# EAGLE design Placa ATMEL 2019 (EAGLE 7.6.0)
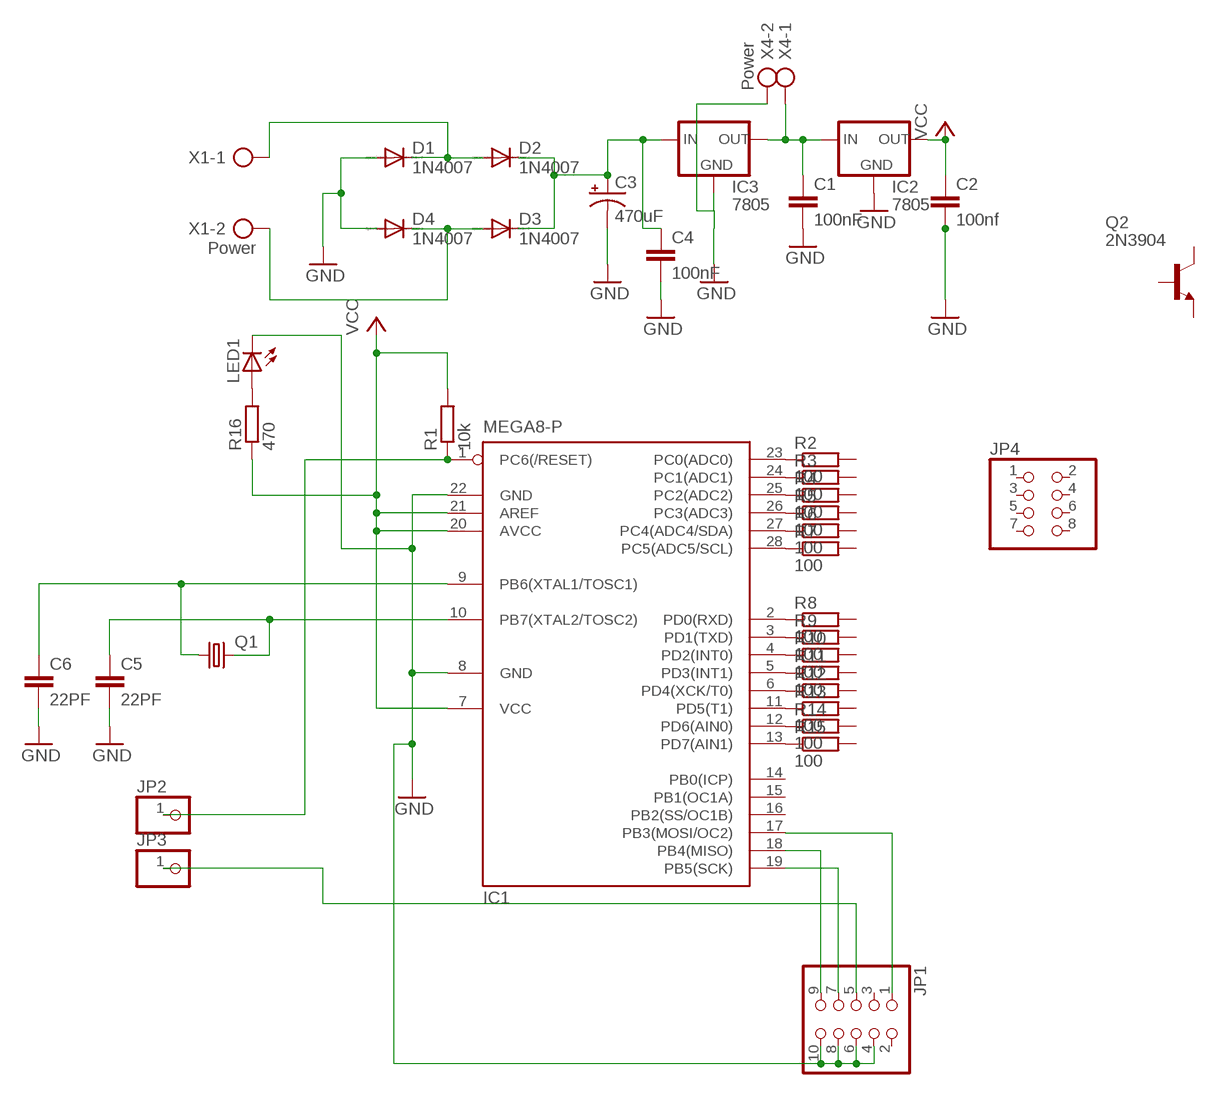
[diagram p0: schematic, sheet 1]

## Parts
C1  100nF  C-EU050-025X075  [C050-025X075]
C2  100nf  C-EU050-025X075  [C050-025X075]
C3  470uF  CPOL-USE7.5-16  [E7,5-16]
C4  100nF  C-EU050-025X075  [C050-025X075]
C5  22PF  C-EU050-024X044  [C050-024X044]
C6  22PF  C-EU050-024X044  [C050-024X044]
D1  1N4007  1N4004  [DO41-10]
D2  1N4007  1N4004  [DO41-10]
D3  1N4007  1N4004  [DO41-10]
D4  1N4007  1N4004  [DO41-10]
IC1  MEGA8-P  [DIL28-3]
IC2  7805  78XXL  [78XXL]
IC3  7805  78XXL  [78XXL]
JP1  PINHD-2X5  [2X05]
JP2  PINHD-1X1  [1X01]
JP3  PINHD-1X1  [1X01]
JP4  PINHD-2X4  [2X04]
LED1  LED5MM  [LED5MM]
Q1  CRYSTALHC49S  [HC49/S]
Q2  2N3904  [TO92]
R1  10k  R-EU_0207/10  [0207/10]
R2  100  R-EU_0207/10  [0207/10]
R3  100  R-EU_0207/10  [0207/10]
R4  100  R-EU_0207/10  [0207/10]
R5  100  R-EU_0207/10  [0207/10]
R6  100  R-EU_0207/10  [0207/10]
R7  100  R-EU_0207/10  [0207/10]
R8  100  R-EU_0207/10  [0207/10]
R9  100  R-EU_0207/10  [0207/10]
R10  100  R-EU_0207/10  [0207/10]
R11  100  R-EU_0207/10  [0207/10]
R12  R-EU_0207/10  [0207/10]
R13  100  R-EU_0207/10  [0207/10]
R14  100  R-EU_0207/10  [0207/10]
R15  100  R-EU_0207/10  [0207/10]
R16  470  R-EU_0309/10  [0309/10]
X1  Power  AK500/2  [AK500/2]
X4  Power  AK500/2  [AK500/2]

## Nets
GND: C1.2 C2.2 C3.- C4.2 C5.2 C6.2 D1.A D4.A IC1.8(GND) IC1.22(GND) IC2.GND IC3.GND JP1.4 JP1.6 JP1.8 JP1.10 LED1.K(C) X4.2
N$1: JP1.5 JP3.1
N$2: IC1.23(PC0(ADC0)) R2.1
N$3: IC1.24(PC1(ADC1)) R3.1
N$4: IC1.25(PC2(ADC2)) R4.1
N$5: IC1.27(PC4(ADC4/SDA)) R6.1
N$6: IC1.28(PC5(ADC5/SCL)) R7.1
N$7: IC1.2(PD0(RXD)) R8.1
N$8: IC1.3(PD1(TXD)) R9.1
N$9: IC1.4(PD2(INT0)) R10.1
N$10: IC1.5(PD3(INT1)) R11.1
N$11: IC1.6(PD4(XCK/T0)) R12.1
N$12: IC1.11(PD5(T1)) R13.1
N$13: IC1.12(PD6(AIN0)) R14.1
N$14: IC1.13(PD7(AIN1)) R15.1
N$15: IC1.26(PC3(ADC3)) R5.1
N$16: IC1.17(PB3(MOSI/OC2)) JP1.1
N$17: LED1.A R16.2
N$18: IC1.19(PB5(SCK)) JP1.7
N$19: IC1.18(PB4(MISO)) JP1.9
N$22: C3.+ C4.1 D2.C D3.C IC3.IN
N$24: D1.C D2.A X1.1
N$65: D3.A D4.C X1.2
N$111: IC1.1(PC6(/RESET)) JP2.1 R1.1
N$116: C1.1 IC2.IN IC3.OUT X4.1
N$135: C5.1 IC1.10(PB7(XTAL2/TOSC2)) Q1.2
N$136: C6.1 IC1.9(PB6(XTAL1/TOSC1)) Q1.1
VCC: C2.1 IC1.7(VCC) IC1.20(AVCC) IC1.21(AREF) IC2.OUT R1.2 R16.1
Unconnected: IC1.14(PB0(ICP)) IC1.15(PB1(OC1A)) IC1.16(PB2(SS/OC1B)) JP1.2 JP1.3 JP4.1 JP4.2 JP4.3 JP4.4 JP4.5 JP4.6 JP4.7 JP4.8 Q2.1(C) Q2.2(B) Q2.3(E) R2.2 R3.2 R4.2 R5.2 R6.2 R7.2 R8.2 R9.2 R10.2 R11.2 R12.2 R13.2 R14.2 R15.2

## Library data of the parts
C1 C2 C4-C6 = rcl:C-EU: CAPACITOR, European symbol
C3 = rcl:CPOL-US: POLARIZED CAPACITOR, American symbol
D1-D4 = diode:1N4004: DIODE general purpose rectifier, 1 A
IC1 = atmel:MEGA8-P: MICROCONTROLLER 8 Kbytes FLASH, 1 kbytes SRAM, 512 bytes EEPROM, USART, 4-channel 10 bit ADC, 2-channel 8 bit ADC Pin compatible with Atmega48, ATMega88, ATMega168 Source: avr.lbr; OC_FARNELL: unknown; OC_NEWARK: unknown
IC2 IC3 = v-reg:78XXL: VOLTAGE REGULATOR
JP1 = pinhead:PINHD-2X5: PIN HEADER
JP2 JP3 = pinhead:PINHD-1X1: PIN HEADER
JP4 = pinhead:PINHD-2X4: PIN HEADER
LED1 = led:LED: LED OSRAM: - CHIPLED LG R971, LG N971, LY N971, LG Q971, LY Q971, LO R971, LY R971 LH N974, LH R974 LS Q976, LO Q976, LY Q976 LO Q996 - Hyper CHIPLED LW Q18S LB Q993, LB Q99A, LB R99A - SideLED LS A670, LO A670, LY A670, LG A670, LP A670 LB A673, LV A673, LT A673, LW A673 LH A674 LY A675 LS A676, LA A676, LO A676, LY A676, LW A676 LS A679, LY A679, LG A679 - Hyper Micro SIDELED® LS Y876, LA Y876, LO Y876, LY Y876 LT Y87S - SmartLED LW L88C, LW L88S LB L89C, LB L89S, LG L890 LS L89K, LO L89K, LY L89K LS L896, LA L896, LO L896, LY L896 - TOPLED LS T670, LO T670, LY T670, LG T670, LP T670 LSG T670, LSP T670, LSY T670, LOP T670, LYG T670 LG T671, LOG T671, LSG T671 LB T673, LV T673, LT T673, LW T673 LH T674 LS T676, LA T676, LO T676, LY T676, LB T676, LH T676, LSB T676, LW T676 LB T67C, LV T67C, LT T67C, LS T67K, LO T67K, LY T67K, LW E67C LS E67B, LA E67B, LO E67B, LY E67B, LB E67C, LV E67C, LT E67C LW T67C LS T679, LY T679, LG T679 LS T770, LO T770, LY T770, LG T770, LP T770 LB T773, LV T773, LT T773, LW T773 LH T774 LS E675, LA E675, LY E675, LS T675 LS T776, LA T776, LO T776, LY T776, LB T776 LHGB T686 LT T68C, LB T68C - Hyper Mini TOPLED® LB M676 - Mini TOPLED Santana® LG M470 LS M47K, LO M47K, LY M47K Source: http://www.osram.convergy.de LUXEON: - LUMILED® LXK2-PW12-R00, LXK2-PW12-S00, LXK2-PW14-U00, LXK2-PW14-V00 LXK2-PM12-R00, LXK2-PM12-S00, LXK2-PM14-U00 LXK2-PE12-Q00, LXK2-PE12-R00, LXK2-PE12-S00, LXK2-PE14-T00, LXK2-PE14-U00 LXK2-PB12-K00, LXK2-PB12-L00, LXK2-PB12-M00, LXK2-PB14-N00, LXK2-PB14-P00, LXK2-PB14-Q00 LXK2-PR12-L00, LXK2-PR12-M00, LXK2-PR14-Q00, LXK2-PR14-R00 LXK2-PD12-Q00, LXK2-PD12-R00, LXK2-PD12-S00 LXK2-PH12-R00, LXK2-PH12-S00 LXK2-PL12-P00, LXK2-PL12-Q00, LXK2-PL12-R00 Source: www.luxeon.com KINGBRIGHT: KA-3528ASYC Source: www.kingbright.com
Q1 = crystal:CRYSTAL: CRYSTAL; OC_FARNELL: 1667008; OC_NEWARK: unknown
Q2 = transistor-npn:2N3904: NPN Transistor
R1-R16 = rcl:R-EU_: RESISTOR, European symbol
X1 X4 = con-ptr500:AK500/2: CONNECTOR

## Board
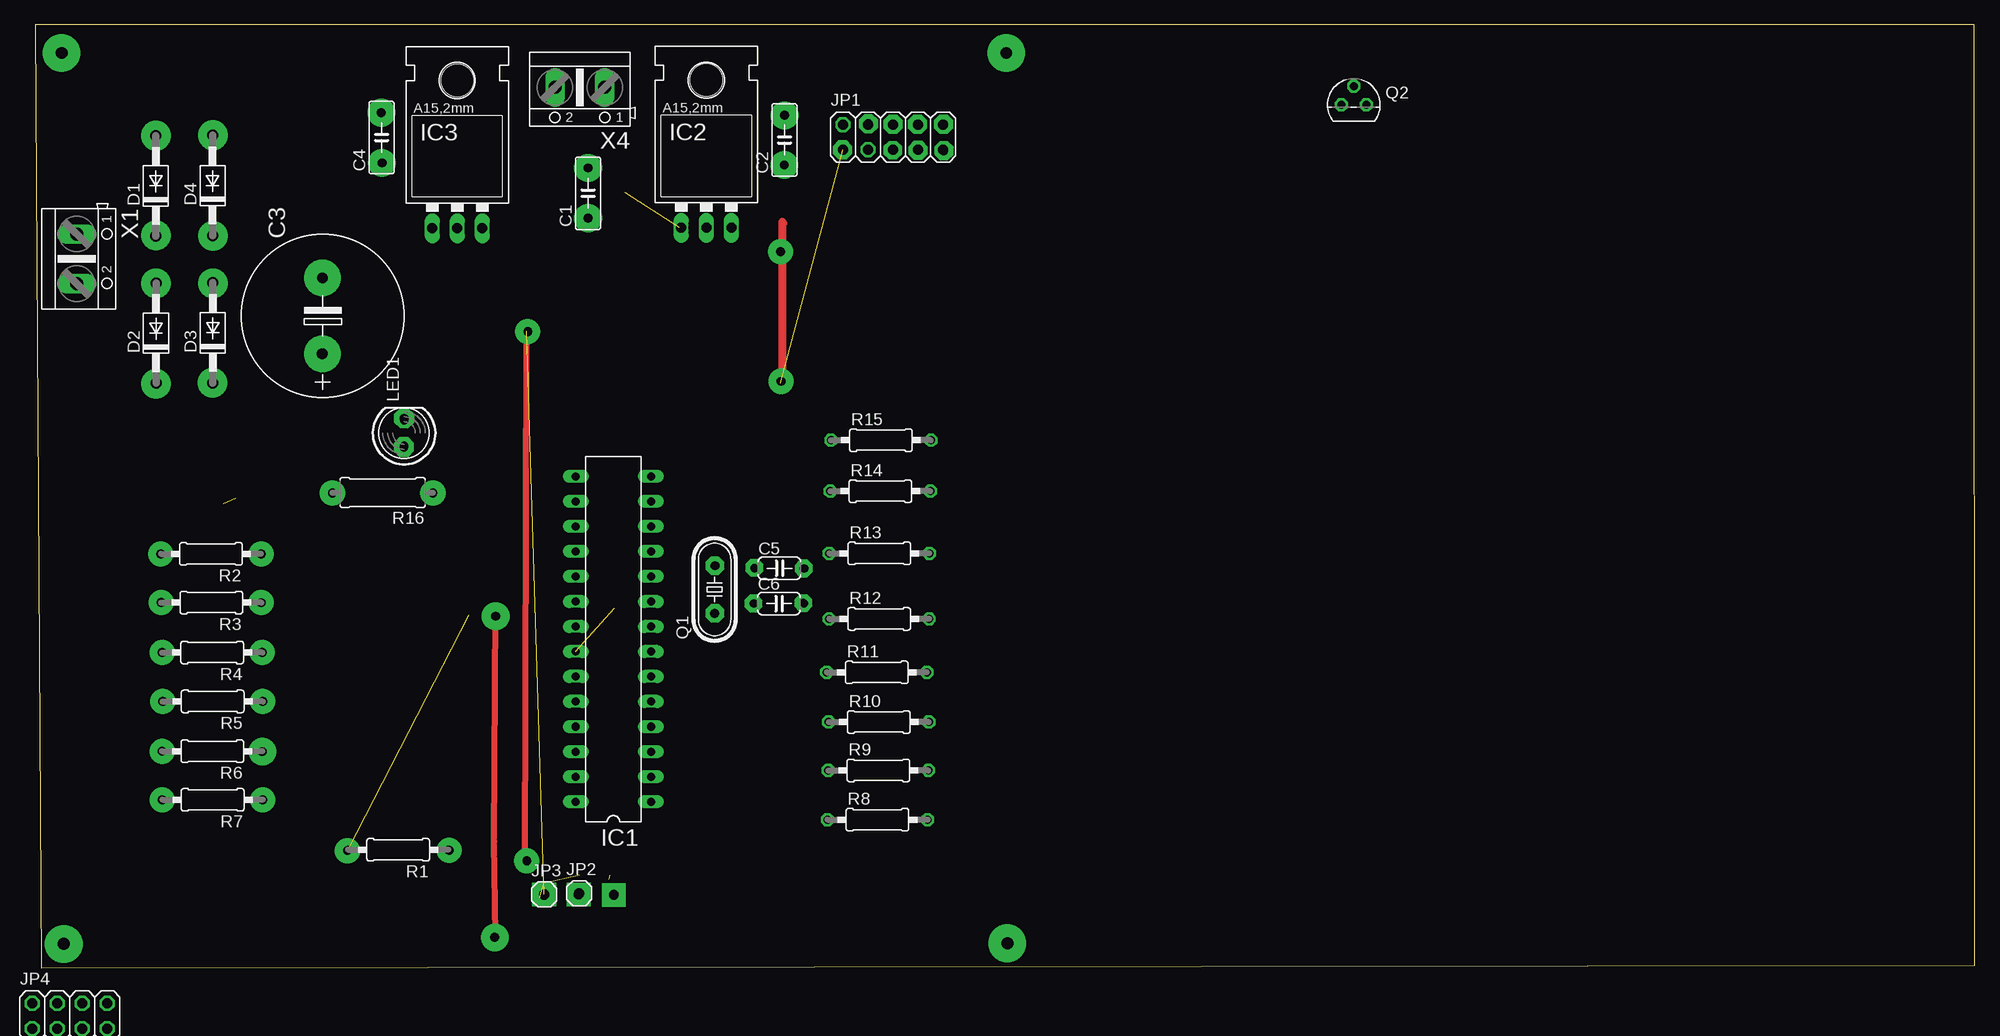
[diagram p1: board, top side]
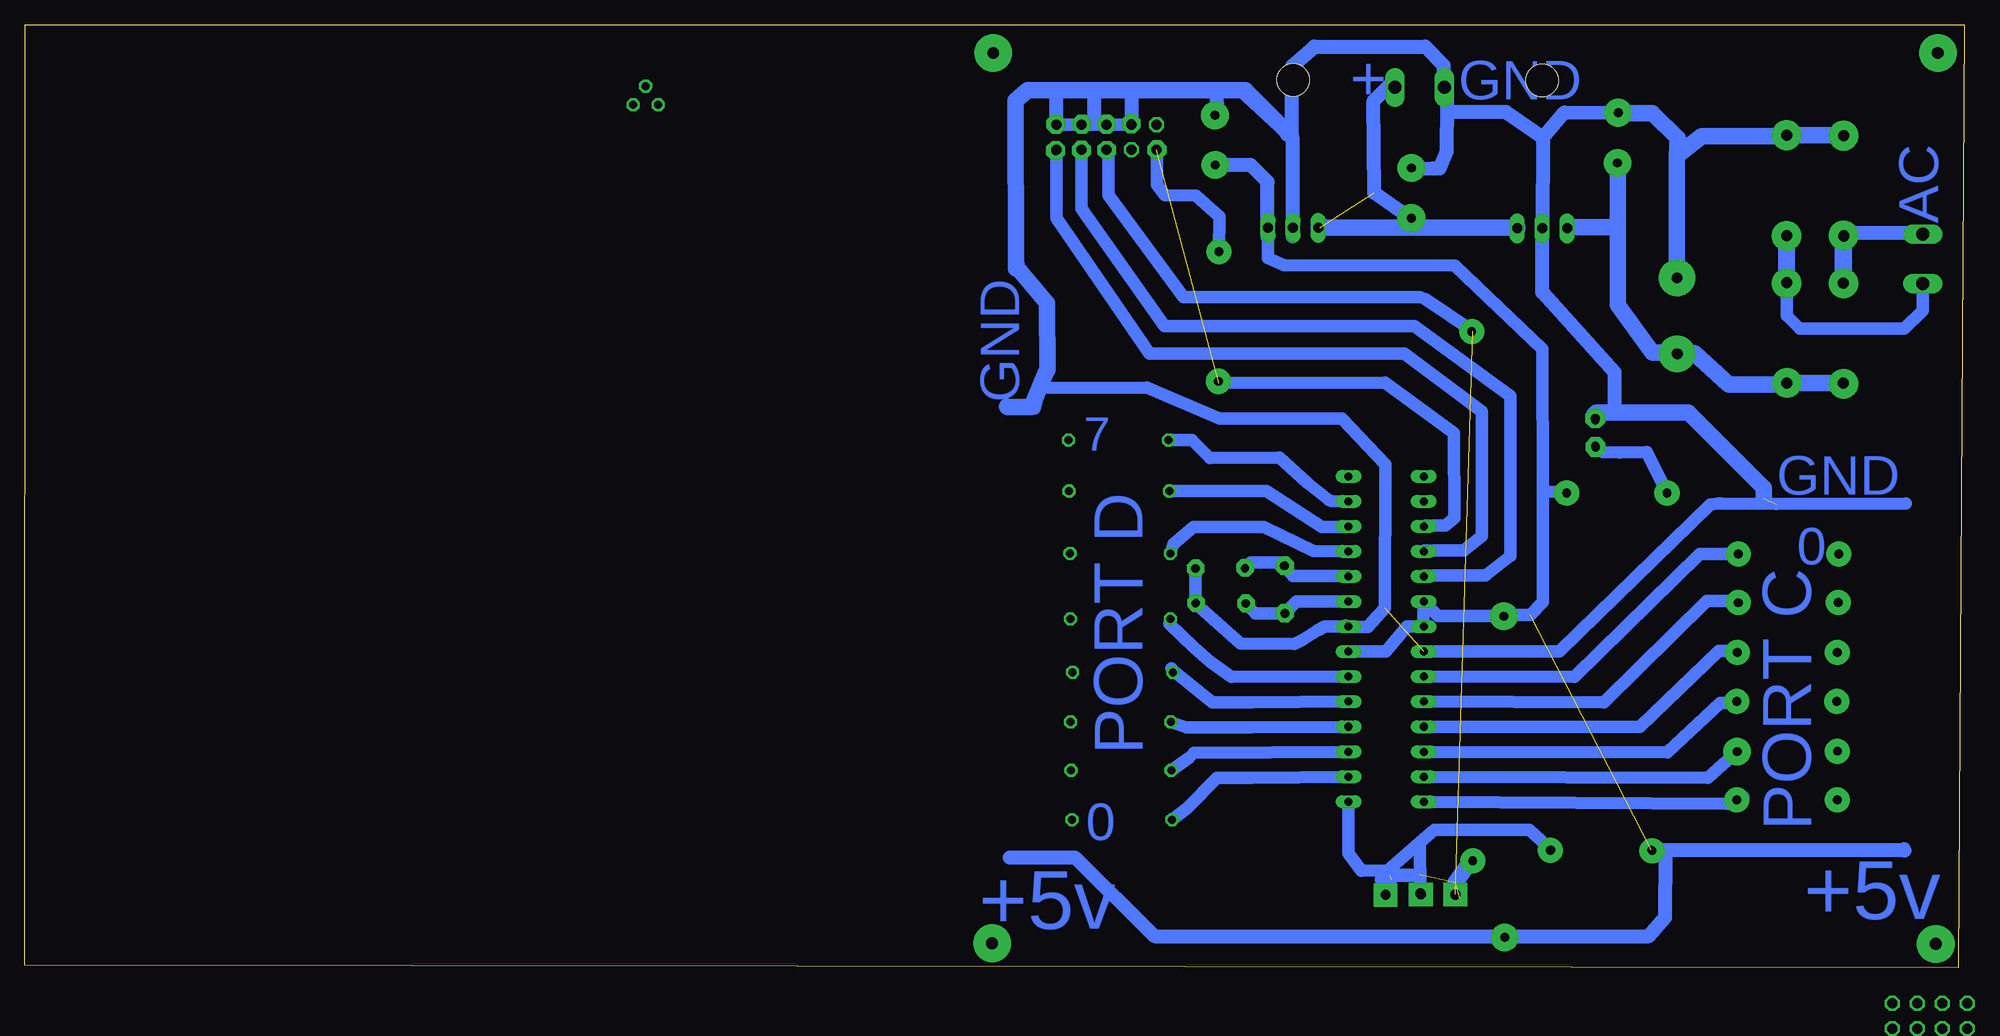
[diagram p2: board, bottom side, seen from below]

Size 196.74 x 95.72 mm. Coordinates in mm from the lower left corner, seen from the top.
Outline: 0.57,0 196.74,0.28 196.7,95.72 0,95.7 0.57,0
Copper layers (1*16): Top 0.035mm / dielectric 1.5mm / Bottom 0.035mm
Design rules "default *": minimum track width 10mil, minimum drill 24mil, track to track 8mil, track to pad 8mil, pad to pad 8mil, via to via 8mil, smd to smd 8mil, copper to edge 40mil, drill to drill 8mil, minimum pad ring 10mil, minimum via ring 8mil, stop-mask expansion 4mil, vias tented up to drill 0mil, thermal gap 10mil

### Footprints (pad centres in the part's own frame; a part is rotated, then mirrored left to right if it is on the bottom)
C050-025X075 = drill 0.813 octagon: 1 -2.54,0; 2 2.54,0
E7,5-16 = drill 1.016 pad 3.15: + -3.81,0 | drill 1.016 pad 3.15 octagon: - 3.81,0
C050-024X044 = drill 0.813 octagon: 1 -2.54,0; 2 2.54,0
DO41-10 = drill 1.118: A 5.08,0; C -5.08,0
DIL28-3 = drill 0.813 long: 1 -16.51,-3.81; 2 -13.97,-3.81; 3 -11.43,-3.81; 4 -8.89,-3.81; 5 -6.35,-3.81; 6 -3.81,-3.81; 7 -1.27,-3.81; 8 1.27,-3.81; 9 3.81,-3.81; 10 6.35,-3.81; 11 8.89,-3.81; 12 11.43,-3.81; 13 13.97,-3.81; 14 16.51,-3.81; 15 16.51,3.81; 16 13.97,3.81; 17 11.43,3.81; 18 8.89,3.81; 19 6.35,3.81; 20 3.81,3.81; 21 1.27,3.81; 22 -1.27,3.81; 23 -3.81,3.81; 24 -6.35,3.81; 25 -8.89,3.81; 26 -11.43,3.81; 27 -13.97,3.81; 28 -16.51,3.81
78XXL = drill 1.016 long: GND 0,-3.81; IN -2.54,-3.81; OUT 2.54,-3.81 | hole 3.302: 0,11.176
2X05 = drill 1.016 octagon: 1 -5.08,-1.27; 2 -5.08,1.27; 3 -2.54,-1.27; 4 -2.54,1.27; 5 0,-1.27; 6 0,1.27; 7 2.54,-1.27; 8 2.54,1.27; 9 5.08,-1.27; 10 5.08,1.27
1X01 = drill 1.016 octagon: 1 0,0
2X04 = drill 1.016 octagon: 1 -3.81,-1.27; 2 -3.81,1.27; 3 -1.27,-1.27; 4 -1.27,1.27; 5 1.27,-1.27; 6 1.27,1.27; 7 3.81,-1.27; 8 3.81,1.27
LED5MM = drill 0.813 octagon: A -1.27,0; K 1.27,0
HC49/S = drill 0.813: 1 -2.413,0; 2 2.413,0
TO92 = drill 0.813 octagon: 1 1.27,0; 2 0,1.905; 3 -1.27,0
0207/10 = drill 0.813 octagon: 1 -5.08,0; 2 5.08,0
0309/10 = drill 0.813 octagon: 1 -5.08,0; 2 5.08,0
AK500/2 = drill 1.321 long: 1 -2.515,0; 2 2.515,0

### Placement (x,y rotation side)
C1  56.05,78.61 90 top
C2  75.98,84.02 90 top
C3  29.15,66.17 90 top
C4  35.11,84.26 90 top
C5  75.47,40.56 0 top
C6  75.42,36.98 0 top
D1  12.22,79.36 90 top
D2  12.23,64.42 90 top
D3  17.99,64.45 90 top
D4  17.98,79.4 90 top
IC1  58.63,33.38 90 top
IC2  68.06,78.91 0 top
IC3  42.79,78.88 0 top
JP1  86.99,84.31 0 top
JP2  55.17,7.6 0 top
JP3  51.62,7.46 0 top
JP4  3.48,-4.87 0 top  (outside the outline)
LED1  37.4,54.28 90 top
Q1  68.9,38.41 90 top
Q2  133.74,87.59 0 top
R1  36.8,12 180 top
R2  17.81,42.02 180 top
R3  17.84,37.08 180 top
R4  17.93,32.01 180 top
R5  17.98,27.05 180 top
R6  17.94,22 180 top
R7  17.98,17.07 180 top
R8  85.42,15.05 0 top
R9  85.51,20.05 0 top
R10  85.55,24.95 0 top
R11  85.35,30 0 top
R12  85.59,35.42 0 top
R13  85.61,42.07 0 top
R14  85.71,48.38 0 top
R15  85.77,53.55 0 top
R16  35.22,48.24 180 top
X1  4.19,71.96 270 top
X4  55.23,89.36 180 top

### Tracks (layer width: path | path; a pad name or v marks a point on that pad's centre or on a via)
GND  (via drill 0.9 pad 2)  (2 unrouted)
  Bottom 0.406: 97.08,56.88 96.98,56.88 96.98,56.79 94.29,56.79 94.29,57.7
  Bottom 1.27: 97.08,56.76 97.08,56.88 | IC2.GND 68.1,74.26 | 84.45,88.88 82.96,88.94 75.79,88.94 73.44,89.08 68.1,84.1 68.23,84.19 | JP1.4 JP1.6 JP1.8 JP1.10 | 52.44,86.86 52.44,87.82 X4.2 | C5.2 77.97,39.82 C6.2 73.41,32.95 67.94,32.9 67.14,33.3 65.58,34.26 64.84,34.64 IC1.8 62.74,34.75 62.69,34.61 60.5,34.6 58.75,36.55 | 58.75,36.55 60.05,35.11 | 37.49,56.17 37.49,55.86 v37.42,55.78 v37.4,55.78 v37.39,55.77 v37.4,55.76 LED1.K | 5.94,47.11 19.03,47.09 24.65,47.11 24.95,47.14 25.75,47.05 41.07,32.1 54.79,32.14 IC1.22 | 94.29,56.79 93.8,58.85 82.87,58.88 75.54,55.73 63.11,55.73 58.7,51.1 58.75,36.55
  Bottom 1.422: 68.1,74.26 68.1,84.1 | 84.45,88.88 JP1.4 | 42.73,84.23 40.53,86.82 C4.2 | 42.73,84.23 46.47,86.86 52.44,86.86 | C1.2 53.91,81.13 53.18,81.15 52.48,82.81 52.44,87.82 | C2.2 75.72,86.82 75.79,88.94 | 68.23,84.19 68.16,84.45 68.16,91.51 65.91,93.5 54.66,93.5 52.81,91.59 X4.2 | 42.83,74.71 IC3.GND | 42.73,84.23 42.77,74.95 IC3.GND | 27.97,56.35 28.04,56.42 35.18,56.42 35.45,56.69 35.45,60.43 42.79,68.57 IC3.GND
  Bottom 1.676: D1.A 12.26,84.48 D4.A 18.08,84.38 26.61,84.38 29.16,82.41 | 29.16,82.41 C3.- | C4.2 34.93,86.75 31.62,86.75 29.02,84.19 29.16,82.41 | 37.49,56.17 37.31,56.35 27.97,56.35 20.3,48.68 20.3,47.63
N$1  (1 unrouted)
  Bottom 1.27: JP1.5 86.82,82.68 86.82,78.41 79.18,68.09 55.22,68.08 54.63,67.85 49.81,64.62
N$2
  Bottom 1.27: R2.1 arc45 22.99,41.98 23.04,42.03 26.79,42.03 39.51,29.56 IC1.23
N$3
  Bottom 1.27: R3.1 23.1,37.26 26.1,37.26 36.54,26.94 IC1.24
N$4
  Bottom 1.27: R4.1 23.19,32.19 24.9,32.19 32.91,24.44 IC1.25
N$5
  Bottom 1.27: R6.1 25.98,19.27 IC1.27
N$6
  Bottom 1.27: 22.42,17.35 22.7,17.07 R7.1 23.31,17.32 23.97,16.66 IC1.28
N$7
  Bottom 1.27: IC1.2 72.31,19.29 75.77,19.29 78.85,16.21 R8.1
N$8
  Bottom 1.27: IC1.3 78.11,21.84 78.63,21.32 R9.1
N$9
  Bottom 1.27: IC1.4 72.35,24.41 78.86,24.41 80.43,24.9 R10.1
N$10
  Bottom 1.27: IC1.5 72.27,26.97 76.26,26.97 79.96,29.92 80.1,29.92 80.43,30.4 R11.1
N$11
  Bottom 1.27: IC1.6 74.34,29.56 76.45,31.08 78.13,32.55 80.59,34.89 R12.1
N$12
  Bottom 1.27: IC1.11 66.02,42.31 71.03,44.75 78.17,44.75 80.18,43 R13.1
N$13
  Bottom 1.27: IC1.12 62.51,44.74 65.14,44.76 70.79,48.38 R14.1
N$14
  Bottom 1.27: R15.1 80.66,53.58 78.33,53.58 76.5,51.75 69.45,51.78 66.63,49.23 64.43,47.48 64.18,47.39 IC1.13
N$15
  Bottom 1.27: R5.1 23.19,26.92 24.71,26.92 30.09,21.89 IC1.26
N$16  (1 unrouted)
  Bottom 1.27: IC1.17 54.61,44.88 52.62,44.88 51.7,45.64 51.75,54.29 58.73,59.38 75.57,59.37
N$17
  Bottom 1.27: R16.2 32.18,52.34 34.96,52.31 36.65,52.33 LED1.A
N$18
  Bottom 1.27: IC1.19 54.74,39.81 48.58,39.81 46.04,41.83 46.02,58.01 55.77,65.15 81.1,65.15 89.53,77.04 JP1.7
N$19
  Bottom 1.27: IC1.18 54.74,42.35 50.75,42.35 48.93,43.82 48.92,56.45 56.76,62.32 82.66,62.36 92.07,76.07 JP1.9
N$22
  Bottom 1.422: C3.+ 29.43,62.64 | IC3.IN 40.21,75.11
  Bottom 1.676: D2.C 12.26,59.37 D3.C 18.14,59.22 23.87,59.22 27.37,62.41 C3.+ | 29.43,62.64 29.63,62.44 31.64,62.44 35.14,67.27 35.11,75.17 | 35.11,75.17 C4.1 | 40.21,75.11 40.15,75.17 35.11,75.17
N$23  (via drill 0.9 pad 2)
  other vias: 37.38,52.87
N$24
  Bottom 1.27: X1.1 4.13,74.55 | 11.89,74.28 D1.C
  Bottom 1.422: 4.13,74.55 12.22,74.55 D1.C
  Bottom 1.8: D1.C D2.A
N$38  (via drill 0.9 pad 2.54)
  other vias: 49.85,10.86
N$41  (via drill 1.2 pad 3.81)
  other vias: 2.87,2.45
N$42  (via drill 1.2 pad 3.81)
  other vias: 98.6,2.51
N$43  (via drill 0.9 pad 1.93)
  other vias: 89.49,85.63
N$46  (via drill 0.9 pad 2.54)
  other vias: 31.65,11.91
N$47  (via drill 0.9 pad 2.54)
  other vias: 41.97,11.93
N$48
  Bottom 1.27: 75.57,72.76 75.55,76.24 77.92,78.38 81.06,78.41 81.89,79.47 81.89,82.78
N$49  (via drill 0.9 pad 2.54)
  other vias: 12.72,42.02
N$50  (via drill 0.9 pad 2.54)
  other vias: 12.77,37.08
N$51  (via drill 0.9 pad 2.54)
  other vias: 22.92,37.07
N$52  (via drill 0.9 pad 2.54)
  other vias: 75.64,59.53
N$53
  Bottom 1.27: 68.04,74.43 67.92,74.31
N$54  (3 unrouted)
  Bottom 1.422: 52.16,7.11 51.16,7.1 | 58.24,9.41 55.22,9.45 | 59.09,8.98 58.15,9.01
  Bottom 1.676: 50.16,10.68 51.59,8.62
N$55  (via drill 0.9 pad 1.93)
  other vias: 92.15,82.94
N$56  (via drill 0.9 pad 1.93)
  other vias: 81.86,83.01
N$57
  Top 0.61: 46.68,3.29 46.55,12.82 46.71,36.35
N$59  (via drill 0.9 pad 1.93)
  other vias: 89.55,82.96
N$60  (via drill 0.9 pad 1.93)
  other vias: 86.99,85.63
N$61  (via drill 0.9 pad 1.93)
  other vias: 92.12,85.63
N$62  (via drill 1.2 pad 3.81)
  other vias: 98.49,92.84
N$63  (via drill 1.2 pad 3.81)
  other vias: 2.66,92.85
N$64  (via drill 0.9 pad 1.85)
  other vias: 86.98,82.98
N$65
  Bottom 1.27: X1.2 4.18,69.47 4.18,66.7 6.09,64.88 16.68,64.88 17.99,66.19 D3.A
  Bottom 1.7: D3.A D4.C
N$66  (via drill 0.9 pad 2.54)
  other vias: 75.58,72.7
N$67
  Bottom 1.422: 54.66,7.07 55.7,7.08
N$69  (via drill 0.9 pad 2.8)
  other vias: 23.02,21.95
N$70  (via drill 0.9 pad 2.54)
  other vias: 22.89,42.02
N$73  (via drill 0.9 pad 2.54)
  other vias: 12.86,32.02
N$74  (via drill 0.9 pad 2.54)
  other vias: 23.01,32.02
N$75  (via drill 0.9 pad 2.54)
  other vias: 23.05,27.06
N$76  (via drill 0.9 pad 2.54)
  other vias: 12.9,27.06
N$77  (via drill 0.9 pad 2.54)
  other vias: 12.84,22
N$78  (via drill 0.9 pad 2.54)
  other vias: 12.86,17.08
N$79  (via drill 0.9 pad 2.54)
  other vias: 23.05,17.08
N$94  (via drill 0.9 pad 2.54)
  other vias: 49.95,64.57
N$95
  Bottom 1.422: 58.24,6.99 59.21,6.99
N$98
  Top 0.813: 75.86,75.54 75.75,75.69 75.72,60.13
N$100
  Bottom 1.676: 97.11,56.97 97.06,56.92 94.62,56.92 93.12,60.47
N$101  (via drill 1 pad 3)
  other vias: 12.25,84.45
N$102  (via drill 1 pad 3)
  other vias: 17.99,84.5
N$103  (via drill 1 pad 3)
  other vias: 18.02,74.29
N$104  (via drill 1 pad 3)
  other vias: 12.22,74.35
N$105  (via drill 1 pad 3)
  other vias: 18,69.48
N$106  (via drill 1 pad 3)
  other vias: 12.25,69.48
N$107  (via drill 1 pad 3)
  other vias: 17.97,59.36
N$108  (via drill 1 pad 3)
  other vias: 12.25,59.29
N$111
  Bottom 1.27: R1.1 44.1,14.02 53.75,14.03 55.22,12.77 | 55.22,12.77 JP2.1 | 55.22,12.77 58.47,9.89 61.13,9.87 62.44,11.66 IC1.1
N$114  (via drill 1 pad 2.4)
  other vias: 51.61,7.44
N$115  (via drill 1 pad 2.4)
  other vias: 55.11,7.45
N$116  (via drill 0.9 pad 2.8)  (1 unrouted)
  Bottom 1.422: C1.1 v56.07,76.09 56.11,76.13 56.2,76.13 59.83,78.65 59.91,87.96 58.37,89.5 X4.1
  Bottom 1.676: IC3.OUT 45.33,75.1 IC2.IN 65.37,75.1 65.37,74.92
N$117
  Top 0.61: 50.19,10.99 49.7,9.96 49.83,63.8
N$119  (via drill 0.9 pad 2.8)
  other vias: 46.68,35.7
N$120  (via drill 1 pad 2.4)
  other vias: 58.68,7.41
N$123  (via drill 0.9 pad 2.8)
  other vias: 46.6,3.11
N$124  (via drill 0.9 pad 2.8)
  other vias: 35.08,86.78
N$125  (via drill 0.9 pad 2.8)
  other vias: 35.16,81.69
N$126  (via drill 0.9 pad 2.8)
  other vias: 56.07,81.18
N$127  (via drill 0.9 pad 2.8)
  other vias: 75.99,86.52
N$128
  Bottom 1.676: 92.98,60.69 93.02,67.47 95.74,70.66
N$129
  Bottom 1.676: 96.1,71.4 96.2,70.98 96.21,88.02 95.01,89.05 72.9,89.05 68.6,84.75 68.6,84.64
N$130
  Bottom 1.422: 88.2,85.67 88.23,85.7 88.23,88.71
N$131  (via drill 0.9 pad 1.93)
  other vias: 84.49,85.66
N$132  (via drill 1.1 pad 3.7)
  other vias: 29.1,62.32
N$133  (via drill 1.1 pad 3.7)
  other vias: 29.11,70.02
N$134
  Bottom 1.422: 92.05,85.79 92.08,85.79 92.08,88.62
N$135
  Bottom 1.27: IC1.10 62.48,39.77 68.08,39.77 68.9,40.59 Q1.2 69.23,41.15 72.32,41.15 72.91,40.56 C5.1
N$136
  Bottom 1.27: C6.1 71.9,36 Q1.1 67.71,37.19 IC1.9
N$137  (via drill 0.8 pad 1.78)
  other vias: 72.84,36.99
N$139  (via drill 0.9 pad 2.54)
  other vias: 40.32,48.2
N$140  (via drill 0.9 pad 2.54)
  other vias: 30.13,48.19
N$141  (via drill 0.8 pad 1.78)
  other vias: 72.93,40.61
N$142  (via drill 0.8 pad 1.78)
  other vias: 77.93,40.54
N$143  (via drill 0.8 pad 1.78)
  other vias: 77.9,37.03
N$145  (via drill 0.9 pad 1.9)
  other vias: 68.93,40.82
N$146  (via drill 0.9 pad 1.9)
  other vias: 68.91,35.99
VCC  (via drill 0.9 pad 2.8)  (1 unrouted)
  Bottom 1.27: 6.05,12.13 6.05,11.93 | 31.35,11.93 30.27,11.81 30.12,12 R1.2 | IC2.OUT 70.64,74.04 70.62,72.03 68.99,71.31 51.63,71.29 42.78,62.79 42.74,48.29 | IC1.7 62.41,32.14 58.63,32.14 56.54,34.65 IC1.21 54.87,35.57 IC1.20 53.37,35.74 46.5,35.74 46.4,35.84 44.02,35.84 42.74,37.12 42.74,48.29 | R16.1 39.9,48.35 42.74,48.29
  Bottom 1.422: IC2.OUT 70.65,74.15 70.65,79.77 72.36,81.48 v75.97,81.48 C2.1 | 6.05,11.93 31.35,11.93 | 96.8,11.21 90.21,11.21 82.11,3.22 31.96,3.22 30.31,5.13 30.27,11.81

### Text on the board
Bottom: GND | + | AC | GND | 7 | GND | PORT D | 0 | PORT C | 0 | +5v | +5v